# EAGLE schematic megatari (EAGLE 6.2)
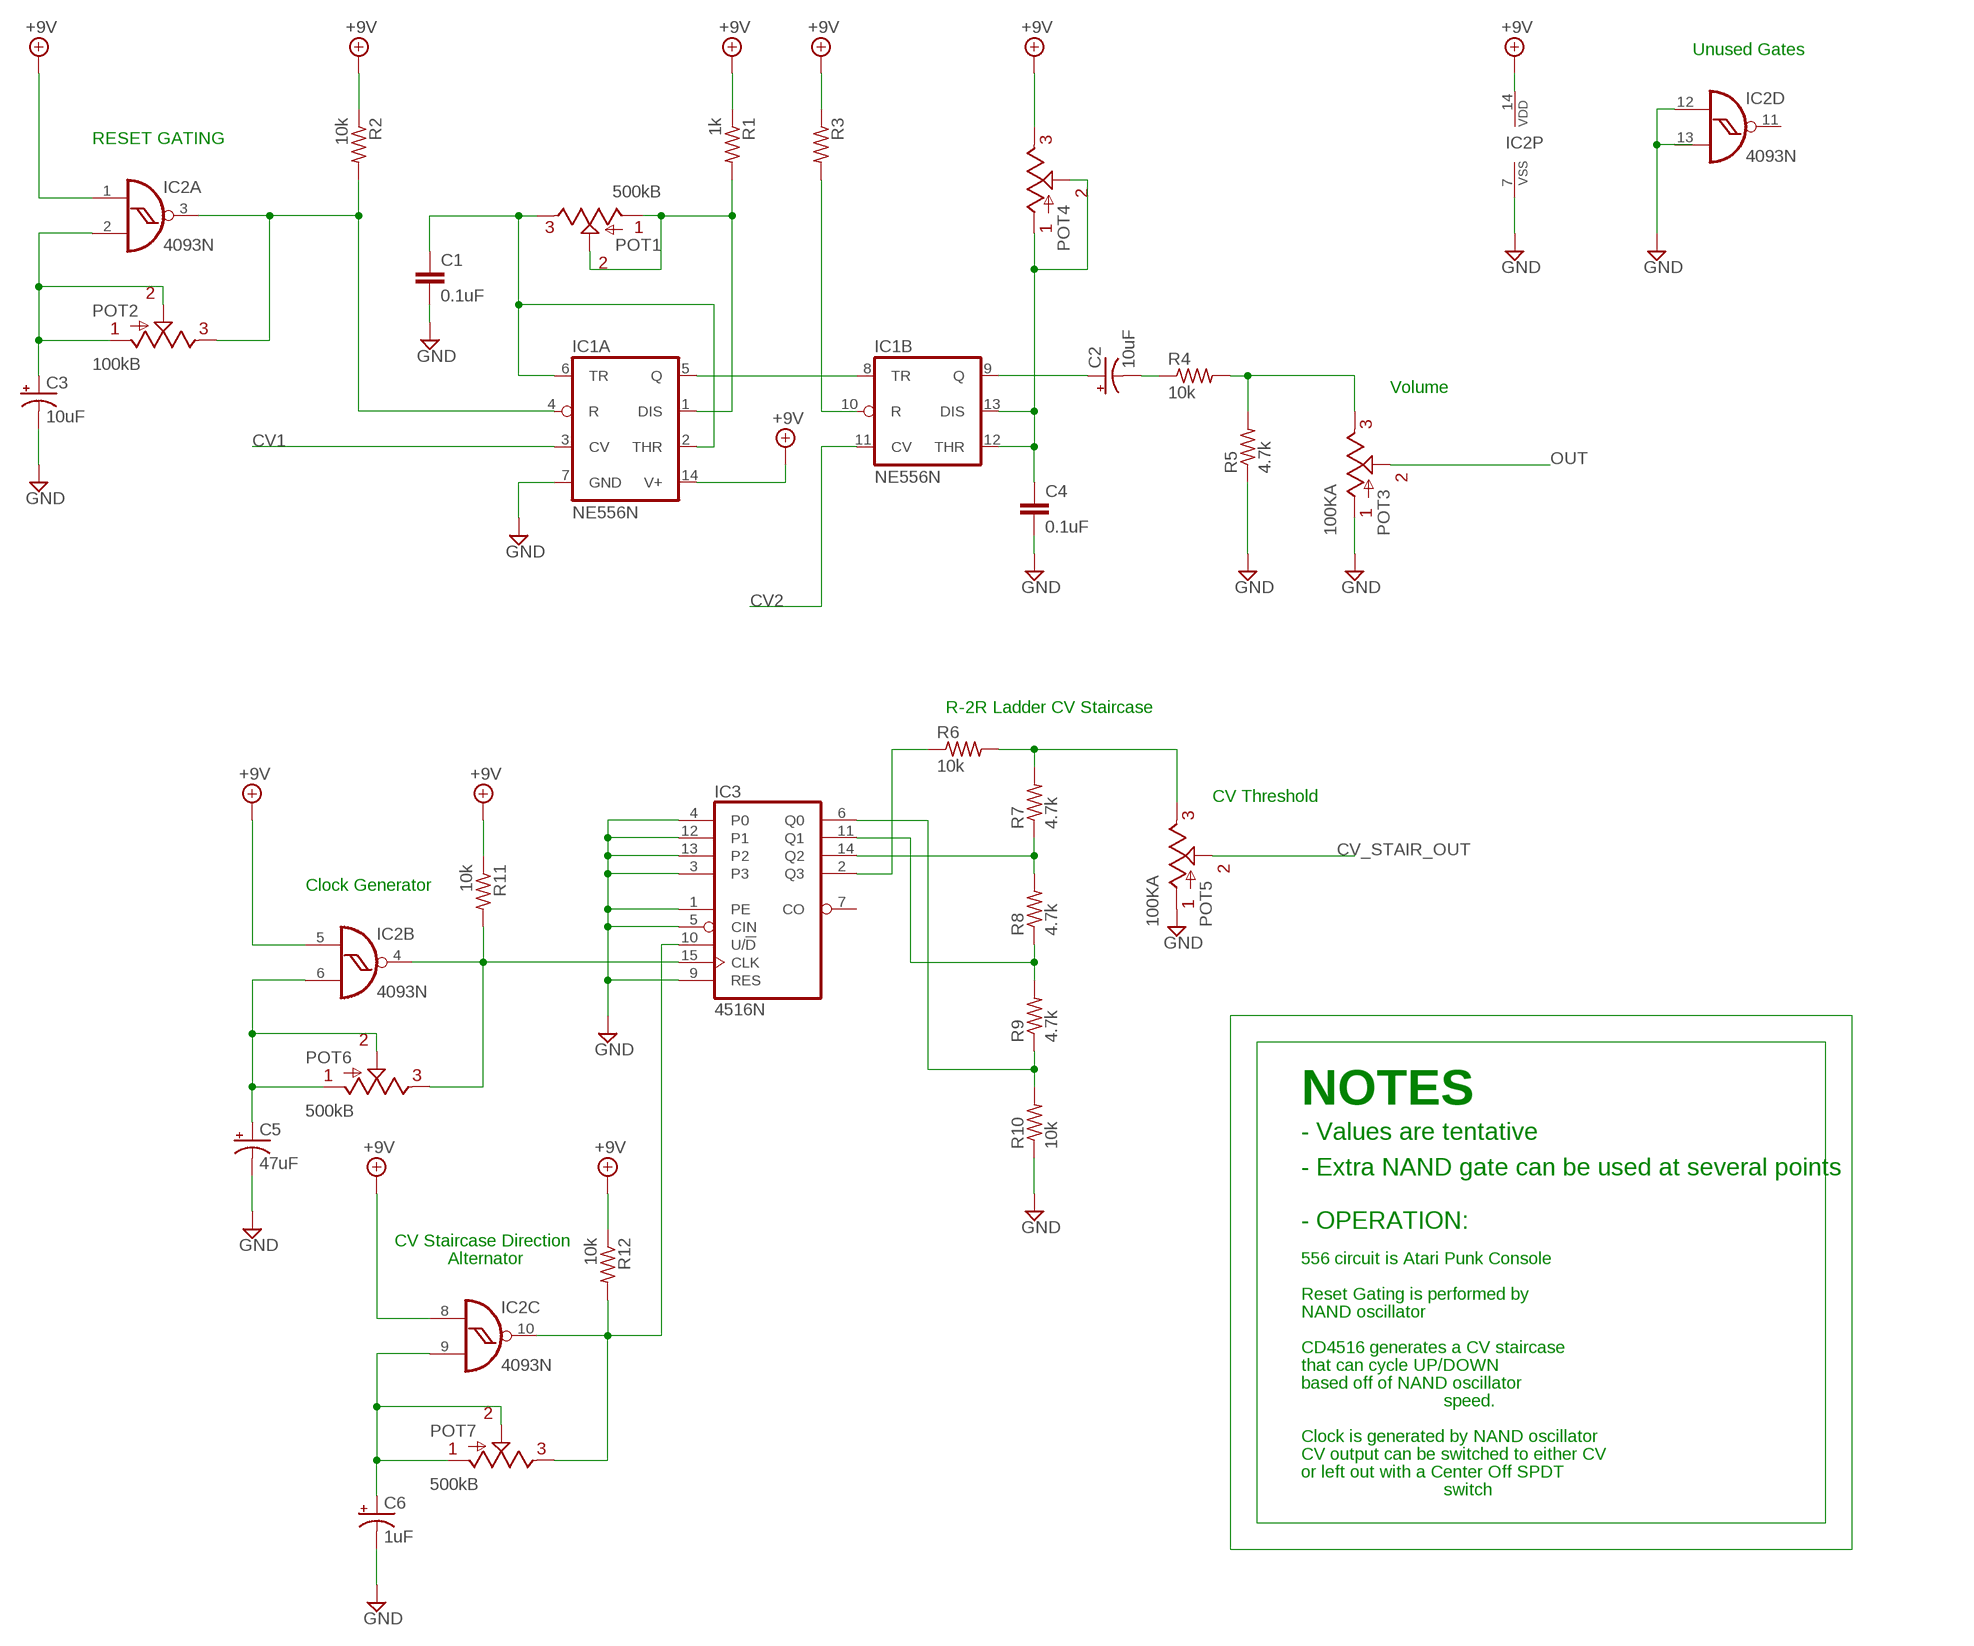
[diagram p0: schematic, sheet 1]

## Parts
C1  0.1uF  CERAMIC_CAPACITOR  [CERAMIC_CAP]
C2  10uF  0501  [050_020_1]
C3  10uF  0501  [050_020_1]
C4  0.1uF  CERAMIC_CAPACITOR  [CERAMIC_CAP]
C5  47uF  0501  [050_020_1]
C6  1uF  0501  [050_020_1]
IC1  NE556N  [DIL14]
IC2  4093N  [DIL14]
IC3  4516N  [DIL16]
POT1  500kB  POT  [POT]
POT2  100kB  POT  [POT]
POT3  100KA  POT  [POT]
POT4  POT  [POT]
POT5  100KA  POT  [POT]
POT6  500kB  POT  [POT]
POT7  500kB  POT  [POT]
R1  1k  RESISTOR  [RESISTOR]
R2  10k  RESISTOR  [RESISTOR]
R3  RESISTOR  [RESISTOR]
R4  10k  RESISTOR  [RESISTOR]
R5  4.7k  RESISTOR  [RESISTOR]
R6  10k  RESISTOR  [RESISTOR]
R7  4.7k  RESISTOR  [RESISTOR]
R8  4.7k  RESISTOR  [RESISTOR]
R9  4.7k  RESISTOR  [RESISTOR]
R10  10k  RESISTOR  [RESISTOR]
R11  10k  RESISTOR  [RESISTOR]
R12  10k  RESISTOR  [RESISTOR]

## Nets
+9V: IC1.14(A:V+) IC2.1(A:I0) IC2.5(B:I0) IC2.8(C:I0) IC2.14(P:VDD) POT4.3 R1.1 R2.1 R3.1 R11.1 R12.1
CV1: IC1.3(A:CV)
CV2: IC1.11(B:CV)
CV_STAIR_OUT: POT5.2
GND: C1.2 C3.- C4.2 C5.- C6.- IC1.7(A:GND) IC2.7(P:VSS) IC2.12(D:I0) IC3.1(PE) IC3.3 IC3.4(P0) IC3.5(CIN) IC3.9(RES) IC3.12(P1) IC3.13(P2) POT3.1 POT5.1 R5.1 R10.1
N$1: IC1.5(A:Q) IC1.8(B:TR)
N$2: IC1.10(B:R) R3.2
N$3: IC1.1(A:DIS) POT1.1 POT1.2 R1.2
N$4: C1.1 IC1.2(A:THR) IC1.6(A:TR) POT1.3
N$5: C2.+ IC1.9(B:Q)
N$6: IC1.4(A:R) IC2.3(A:O) POT2.3 R2.2
N$7: C2.- R4.1
N$8: C3.+ IC2.2(A:I1) POT2.1 POT2.2
N$9: POT3.3 R4.2 R5.2
N$10: POT5.3 R6.2 R7.2
N$11: IC3.11(Q1) R8.1 R9.2
N$12: IC3.14(Q2) R7.1 R8.2
N$13: C4.1 IC1.12(B:THR) IC1.13(B:DIS) POT4.1 POT4.2
N$15: IC3.6(Q0) R9.1 R10.2
N$16: C5.+ IC2.6(B:I1) POT6.1 POT6.2
N$17: IC2.4(B:O) IC3.15(CLK) POT6.3 R11.2
N$18: IC3.2(Q3) R6.1
N$19: C6.+ IC2.9(C:I1) POT7.1 POT7.2
N$20: IC2.10(C:O) IC3.10(U/!D) POT7.3 R12.2
OUT: POT3.2
Unconnected: IC2.11(D:O) IC2.13(D:I1) IC3.7(CO)

## Notes on the sheet
- Unused Gates
- RESET GATING
- Volume
- R-2R Ladder CV Staircase
- CV Threshold
- Clock Generator
- NOTES
- - Values are tentative
- - Extra NAND gate can be used at several points
- - OPERATION:
- CV Staircase Direction
- Alternator | 556 circuit is Atari Punk Console
- Reset Gating is performed by
- NAND oscillator
- CD4516 generates a CV staircase
- that can cycle UP/DOWN
- based off of NAND oscillator
- speed.
- Clock is generated by NAND oscillator
- CV output can be switched to either CV
- or left out with a Center Off SPDT
- switch

## Power pins joined to a net without a drawn wire
VDD: IC3.16(VDD)
VSS: IC3.8(VSS)

## Library data of the parts
C1 C4 = 00_steve:CERAMIC_CAPACITOR
C2 C3 C5 C6 = gm-caps-electro-pol:050: 0.22 - 100uF Xicon values at Mouser.com: 10V: 10 - 100uF; 16V: 2.2 - 47uF; 25V: 0.47 - 47uF; 50V: 0.22 - 22uF
IC1 = linear:*556: Dual TIMER
IC2 = 40xx:4093: Quad 2-input NAND schmitt trigger
IC3 = 45xx:4516: Binary up down COUNTER
POT1-POT7 = 00_steve:POT
R1-R12 = 00_steve:RESISTOR